# Altium schematic sheet Motor_Interface.SchDoc
size B
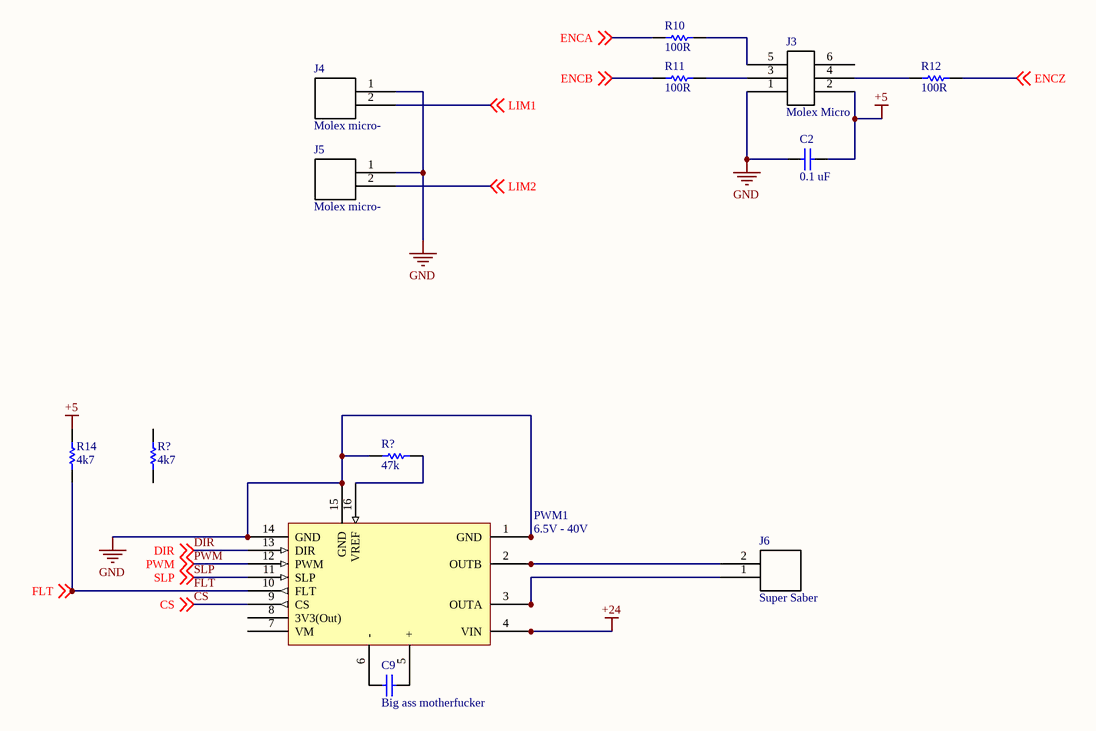
[diagram p0: Motor_Interface.SchDoc]

## Parts
(Parts that share a designator on the sheet are numbered #1, #2 ... from top to bottom, then left to right.)
C2  0.1 uF  [CAPC2013X140X50LL20T25]
C9  Big ass motherfucker  [CAPC2013X140X50LL20T25]
J3  Molex Micro  [microfit 6 pin]
J4  Molex micro-  [Microfit 2 pin]
J5  Molex micro-  [Microfit 2 pin]
J6  Super Saber  [Super Sabre]
PWM1  6.5V - 40V  [Pololu_G2_Driver_24v21]
R10  100R  [RESC0805(2012)_N]
R11  100R  [RESC0805(2012)_N]
R12  100R  [RESC0805(2012)_N]
R14  4k7  [RESC0805(2012)_N]
R?#1  47k  [RESC0805(2012)_N]
R?#2  4k7  [RESC0805(2012)_N]

## Nets
+5: C2.2 J3.2 R14.2
+24: PWM1.4(VIN) PWM1.4a(VIN) PWM1.4b(VIN)
GND: C2.1 J3.1 J4.1 J5.1 PWM1.1(GND) PWM1.1a(GND) PWM1.1b(GND) PWM1.14(GND) PWM1.15(GND) R?#1.1
CS: PWM1.9(CS) ; off-sheet CS
DIR: PWM1.13(DIR) ; off-sheet DIR
ENCA: R10.1 ; off-sheet ENCA
ENCB: R11.1 ; off-sheet ENCB
ENCZ: R12.2 ; off-sheet ENCZ
FLT: PWM1.10(FLT) R14.1 ; off-sheet FLT
LIM1: J4.2 ; off-sheet LIM1
LIM2: J5.2 ; off-sheet LIM2
PWM: PWM1.12(PWM) ; off-sheet PWM
SLP: PWM1.11(SLP) ; off-sheet SLP
NetC9_1: C9.1 PWM1.6(-)
NetC9_2: C9.2 PWM1.5(+)
NetJ3_3: J3.3 R11.2
NetJ3_4: J3.4 R12.1
NetJ3_5: J3.5 R10.2
NetJ6_1: J6.1 PWM1.3(OUTA) PWM1.3a(OUTA) PWM1.3b(OUTA)
NetJ6_2: J6.2 PWM1.2(OUTB) PWM1.2a(OUTB) PWM1.2b(OUTB)
NetPWM1_16: PWM1.16(VREF) R?#1.2

Not connected (* = marked no-connect by the designer): J3 6; PWM1 7(VM) 8(3V3(Out)); R?#2 1 2

## Library data of the parts
C2 C9 = CMP-2000-05810-1: Chip Capacitor, 2.2 uF, +/- 10%, 10 V, -55 to 85 degC, 0805 (2012 Metric), RoHS, Tape and Reel; Manufacturer: AVX; Dielectric: X5R; Rated Voltage: 10V; Capacitance: 2.2µF; Tolerance (%): ±10%; Datasheet Version: 05/2016; Manufacturer URL: http://www.avx.com/; Package Description: 2-Pin Surface Mount Device, Body 2.01 x 1.25 mm; Mounting Technology: SurfaceMount; Case Size/Dimension: 0805; Package Reference: 0805; Datasheet URL: http://datasheets.avx.com/cx5r.pdf
J3 = Molex micro-fit 6-pin (dual row schematic): Molex micro-fit 3.0 dual row connector. P/N 0430450627
J4 J5 = Molex micro-fit 2-pin: Molex micro-fit 3.0. Molex P/N 0430450227
PWM1 = Pololu G2 High-Power Motor Driver 24v21: This discrete MOSFET H-bridge motor driver enables bidirectional control of one high-power DC brushed motor. The small 1.3″ × 0.8″ board supports a wide 6.5 V to 40 V voltage range and is efficient enough to deliver a continuous 21 A without a heat sink. Additional features of this second-generation (G2) driver include reverse-voltage protection along with basic current sensing and current limiting functionality.; ComponentLink1Description: Product Info; ComponentLink1URL: https://www.pololu.com/product/2995/specs
R10-R12 R14 R?#1 R?#2 = Resistor 0805: Generic 0805 Resistor; Tolerance: 5 %; Case-Metric: 2012; Value: 120.00 Ohm; Case-EIA: 0805; Power: 0.125 W; Technology: SMT